# Altium schematic sheet 0177_AUDIO POWER RAILS.SchDoc
size 848 x 558 mm
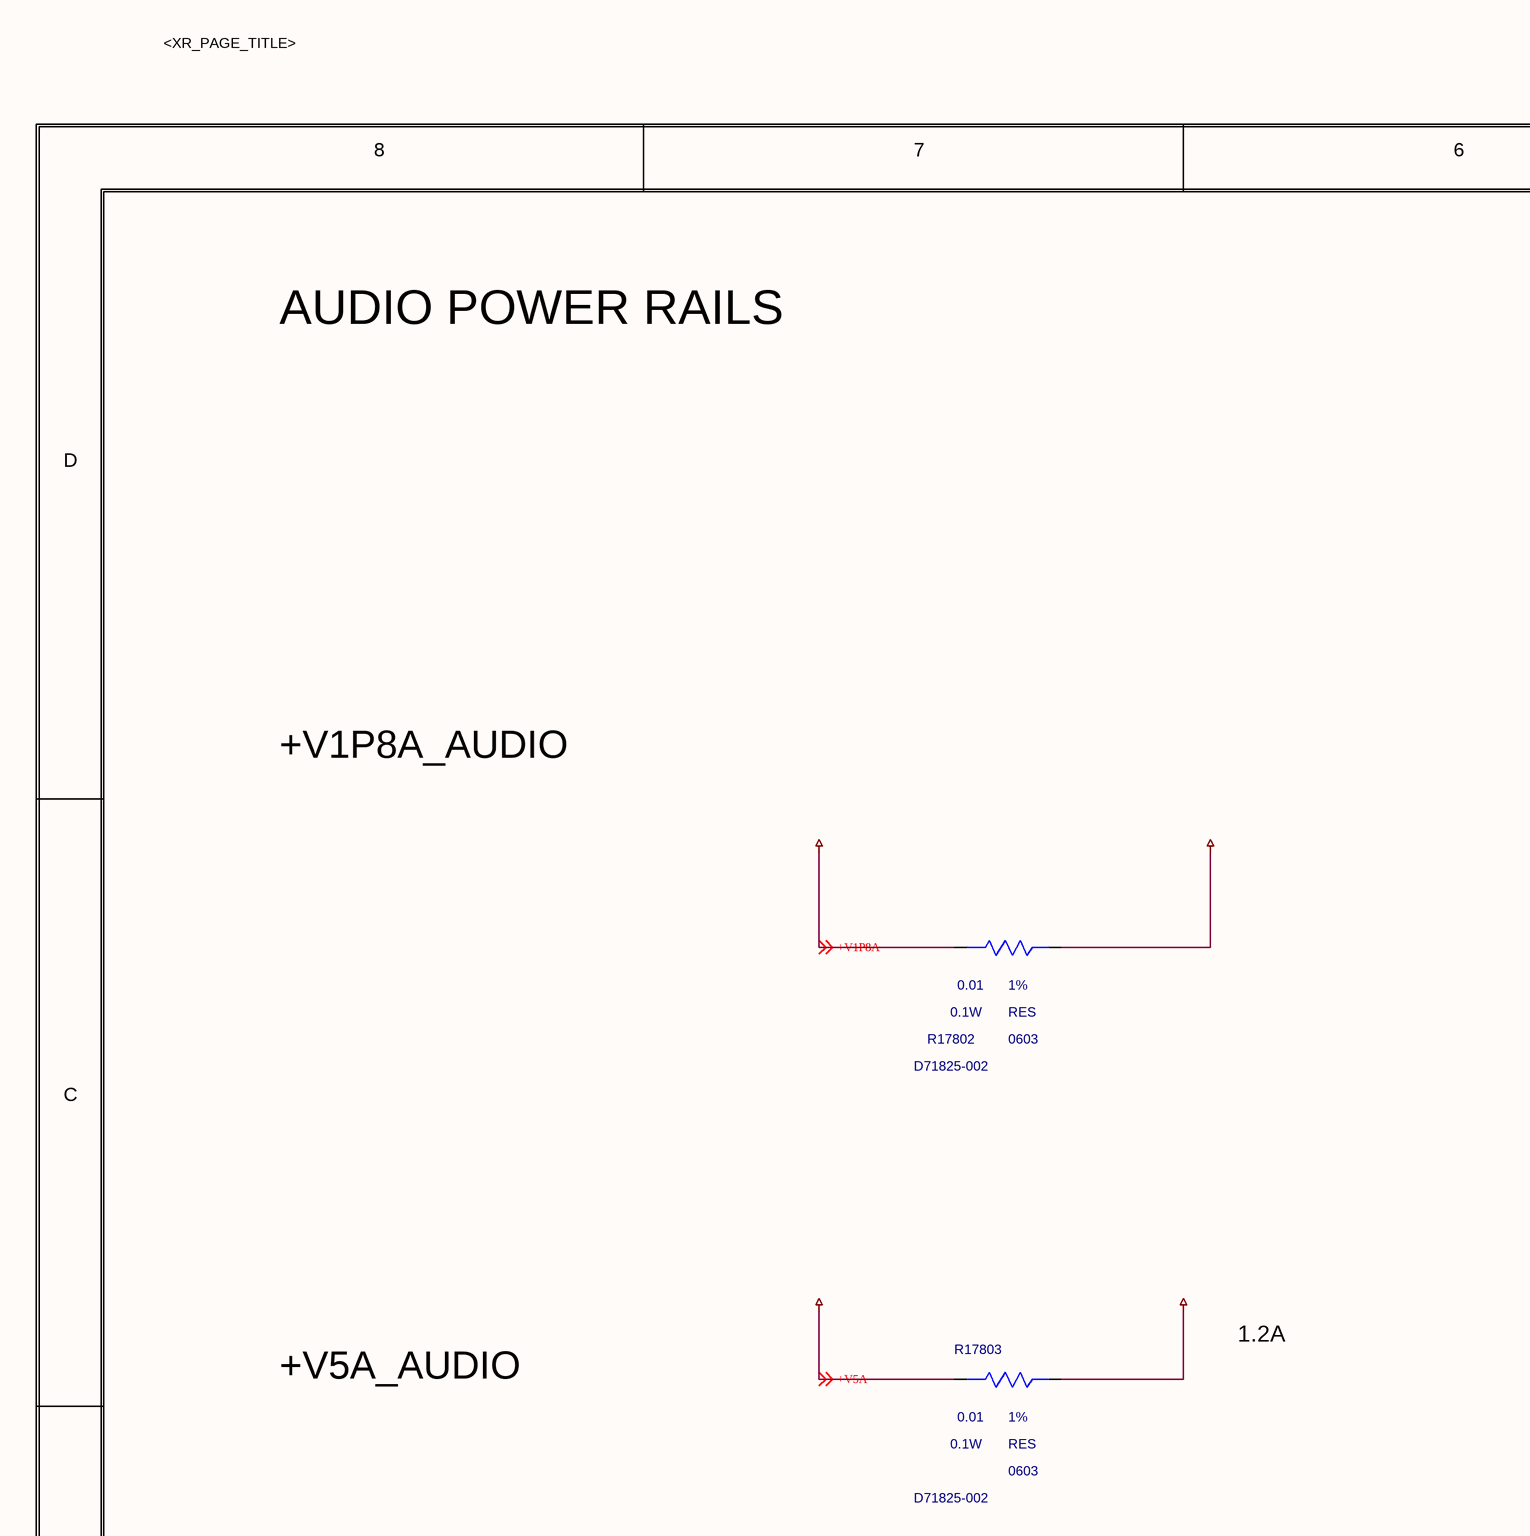
[diagram p0: 0177_AUDIO POWER RAILS.SchDoc, top left]
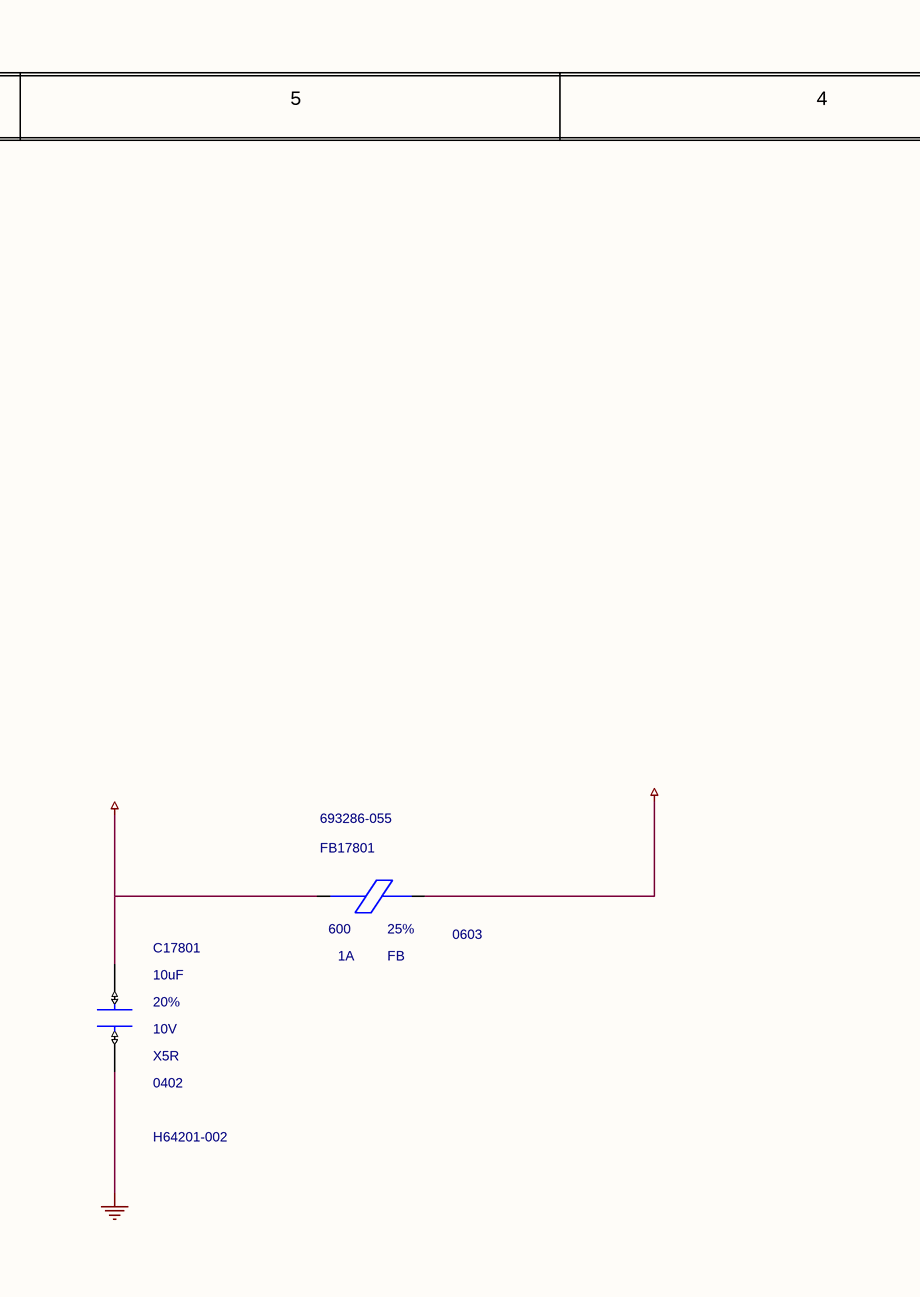
[diagram p1: 0177_AUDIO POWER RAILS.SchDoc, top middle]
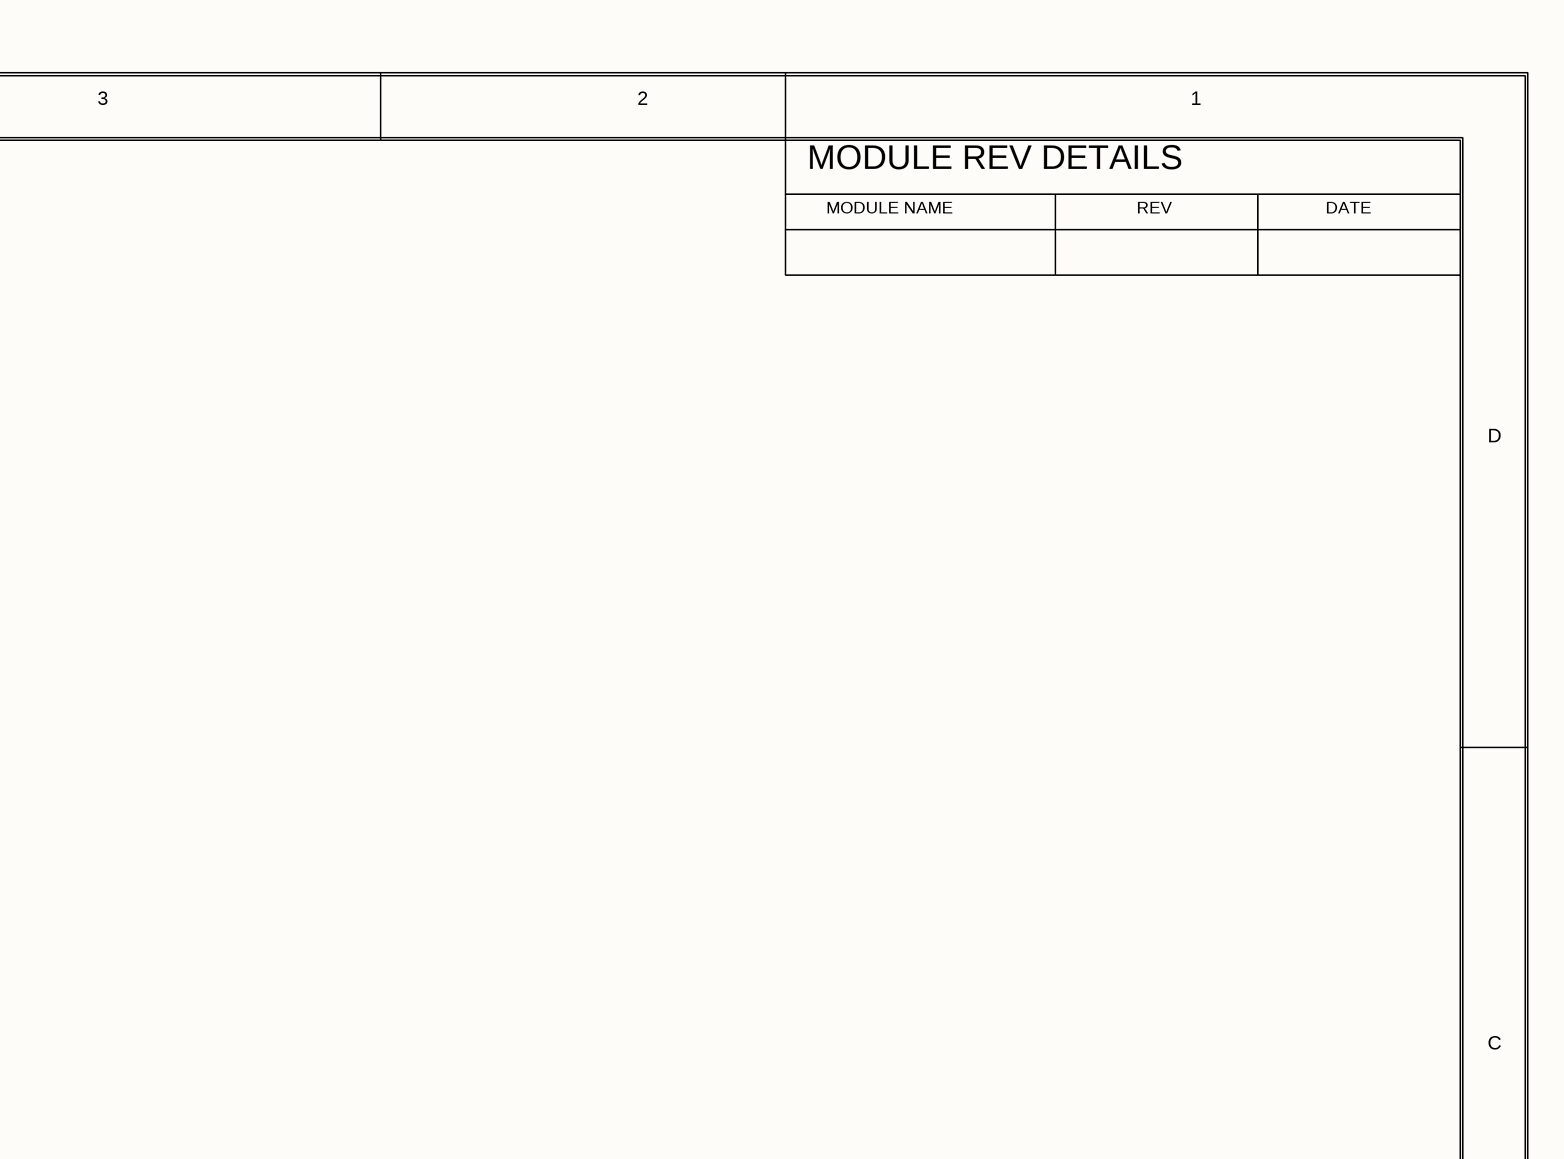
[diagram p2: 0177_AUDIO POWER RAILS.SchDoc, top right]
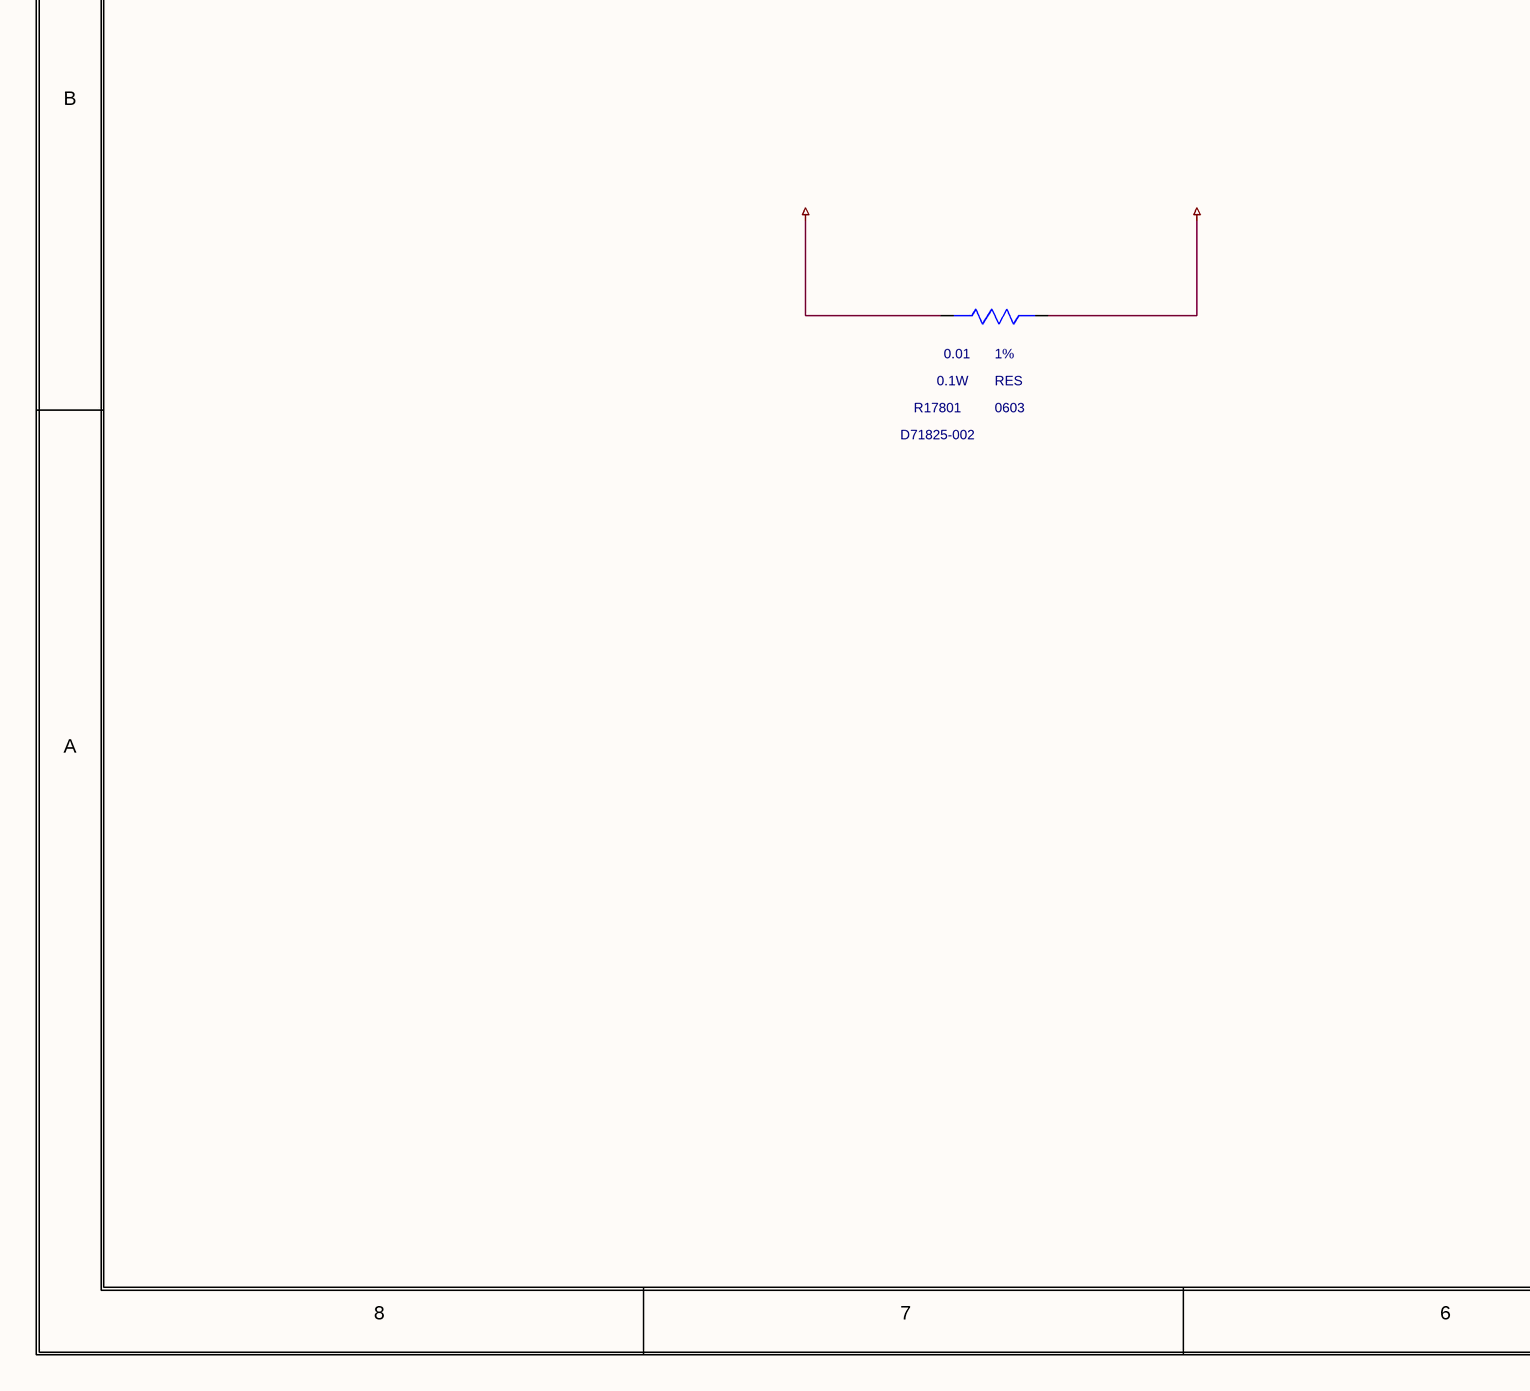
[diagram p3: 0177_AUDIO POWER RAILS.SchDoc, bottom left]
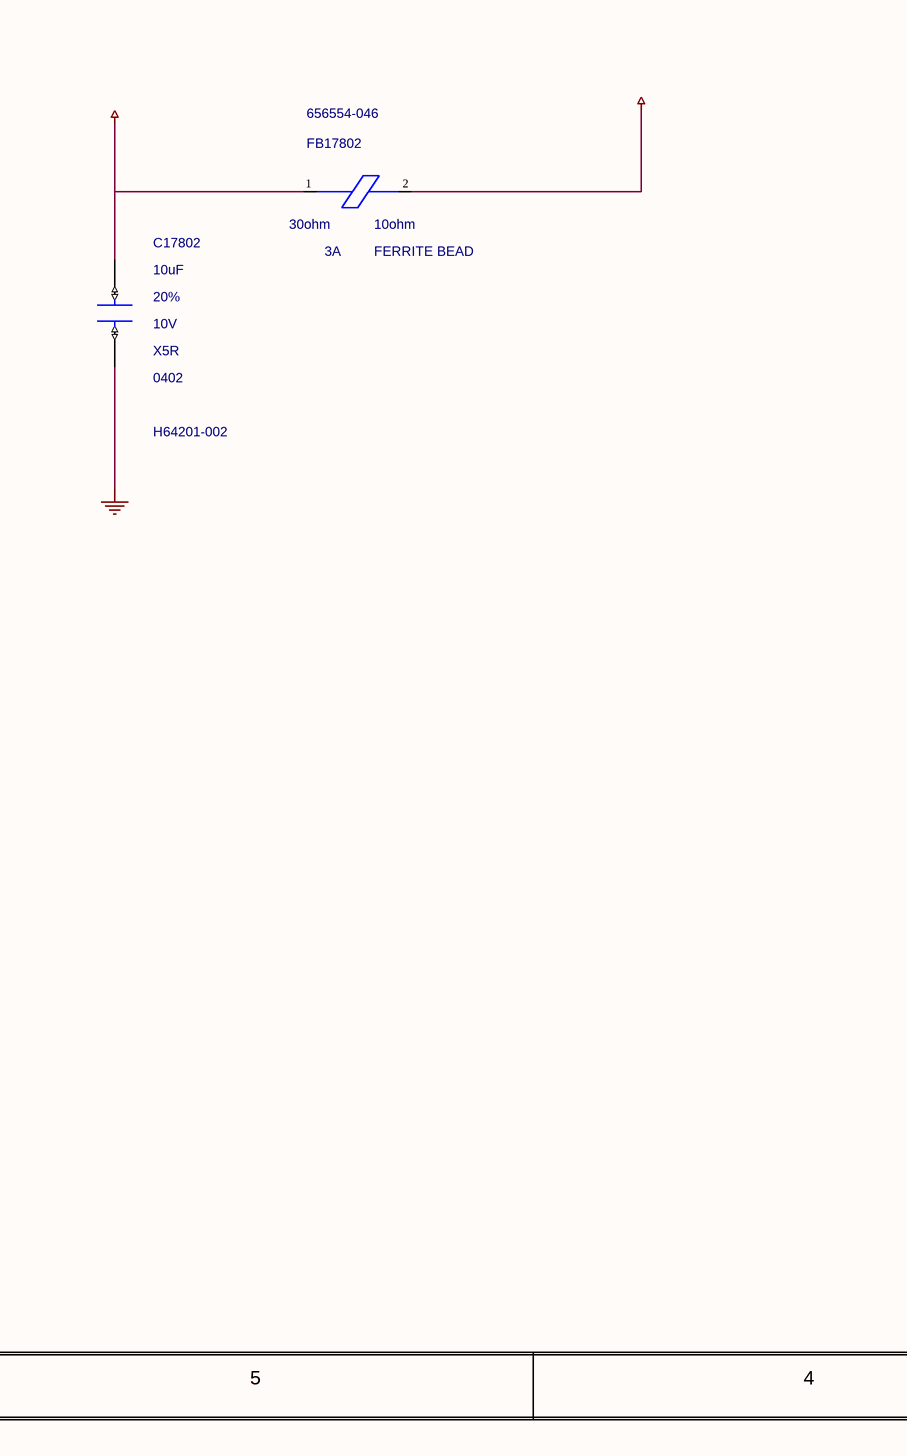
[diagram p4: 0177_AUDIO POWER RAILS.SchDoc, bottom middle]
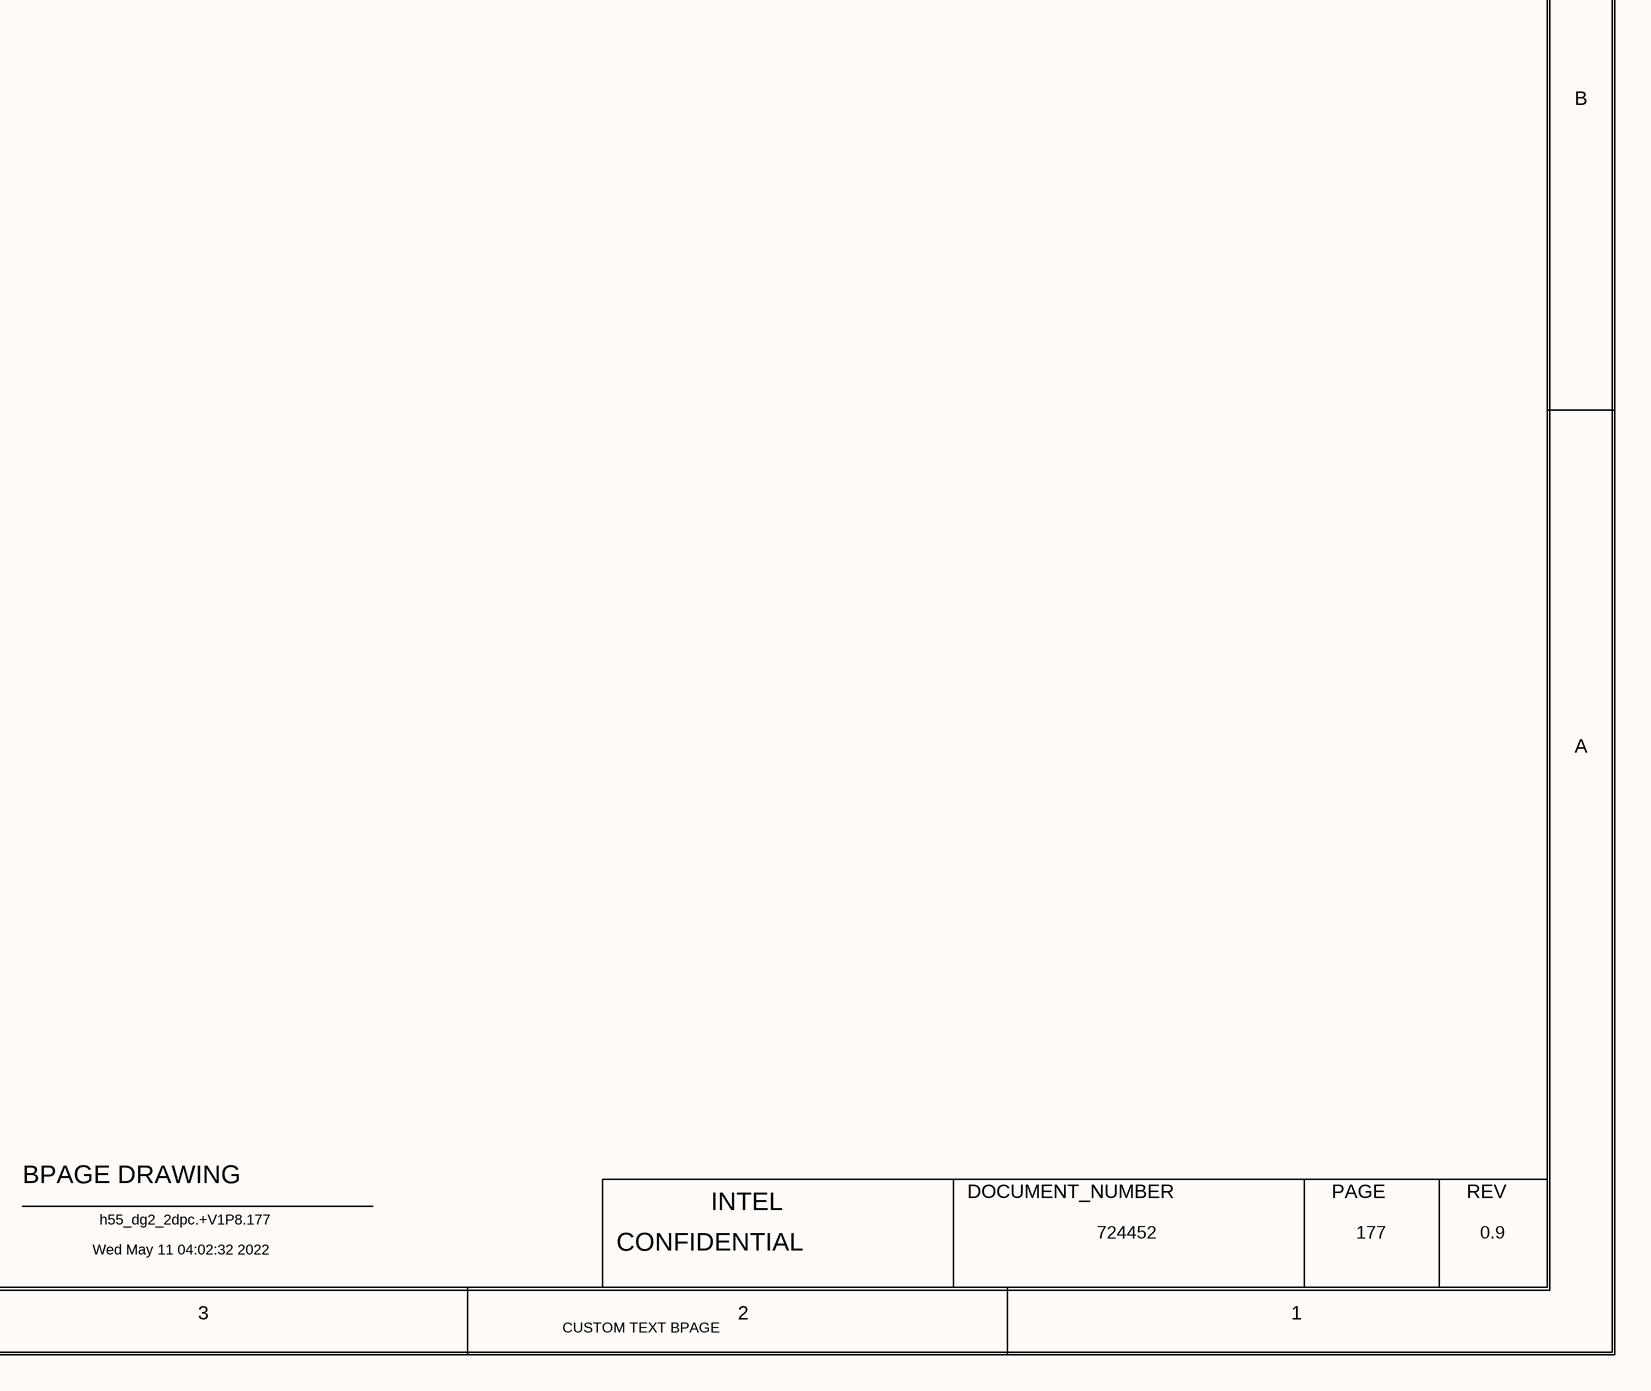
[diagram p5: 0177_AUDIO POWER RAILS.SchDoc, bottom right]

## Parts
C17801  10uF  MATERIAL: X5R  PACK_TYPE: 0402  PART_NUMBER: H64201-002  TOLERANCE: 20%  VOLTAGE: 10V  [CTK2_SM0402_1200X700_MA]
C17802  10uF  MATERIAL: X5R  PACK_TYPE: 0402  PART_NUMBER: H64201-002  TOLERANCE: 20%  VOLTAGE: 10V  [CTK2_SM0402_1200X700_MA]
FB17801  600  CURRENT: 1A  MATERIAL: FB  PACK_TYPE: 0603  PART_NUMBER: 693286-055  TOLERANCE: 25%  [CTK2_SM0603_1750X950_MA]
FB17802  30ohm  CURRENT: 3A  MATERIAL: FERRITE BEAD  PART_NUMBER: 656554-046  TOLERANCE: 10ohm  [SFB0805MA]
R17801  0.01  MATERIAL: RES  PACK_TYPE: 0603  PART_NUMBER: D71825-002  TOLERANCE: 1%  WATTAGE: 0.1W  [CTK2_SM0603_1800X1014_MA]
R17802  0.01  MATERIAL: RES  PACK_TYPE: 0603  PART_NUMBER: D71825-002  TOLERANCE: 1%  WATTAGE: 0.1W  [CTK2_SM0603_1800X1014_MA]
R17803  0.01  MATERIAL: RES  PACK_TYPE: 0603  PART_NUMBER: D71825-002  TOLERANCE: 1%  WATTAGE: 0.1W  [CTK2_SM0603_1800X1014_MA]

## Nets
+V1P8A: R17802.1(A) ; off-sheet +V1P8A
+V1P8A_AUDIO: C17801.1(A) FB17801.1(A) R17802.2(B)
+V1P8A_AUDIO_FIL: FB17801.2(B)
+V5A: R17803.1(A) ; off-sheet +V5A
+V5A_AUDIO: C17802.1(A) FB17802.1(A) R17803.2(B)
+V5A_AUDIO_FIL: FB17802.2(B)
+VBATA: R17801.1(A)
+VBATA_SPK: R17801.2(B)
GND: C17801.2(B) C17802.2(B)

## Notes on the sheet
- <XR_PAGE_TITLE>
- 8
- 7
- 6
- 5
- 4
- 3
- 2
- 1
- MODULE REV DETAILS
- MODULE NAME
- REV
- DATE
- AUDIO POWER RAILS
- D
- +V1P8A_AUDIO
- C
- +V5A_AUDIO
- 1.2A
- B
- A
- BPAGE DRAWING
- INTEL
- DOCUMENT_NUMBER
- PAGE
- Wed May 11 04:02:32 2022
- h55_dg2_2dpc.+V1P8.177
- CONFIDENTIAL
- 724452
- 177
- 0.9
- CUSTOM TEXT BPAGE

## Library data of the parts
C17801 = C_CAP: CDS_PHYS_PART_NAME: C_CAP_0402-H64201-002,X5R,10UF,10V,20%,TK2,GENERIC; CDS_LMAN_SYM_OUTLINE: -50,50,50,-50; FP_TECH: TK2; IP: GENERIC; ROOM: NONE; OriginalSymbolOrigin: (-50,25); XY: (5950,1400); VER: 1; ROT: 0; PHYS_PAGE: 177; LOCATION: C17801; DRAWING: @RVP1_ADL_SB_ADP_S_DDR5_SODIMM_2DPC_LIB.H55_DG2_2DPC(SCH_1):PAGE546; CDS_LIB: c_discrete; VARIANT: ?; PCB Footprint: CTK2_SM0402_1200X700_MA; CHIPS_PART_NAME: C_CAP; CDS_PART_NAME: C_CAP_0402-H64201-002,X5R,10UF,10V,20%,TK2,GENERIC; CDS_LOCATION: C17801
C17802 = C_CAP: CDS_PHYS_PART_NAME: C_CAP_0402-H64201-002,X5R,10UF,10V,20%,TK2,GENERIC; CDS_LMAN_SYM_OUTLINE: -50,50,50,-50; FP_TECH: TK2; IP: GENERIC; ROOM: NONE; OriginalSymbolOrigin: (-50,25); XY: (6000,-50); VER: 1; ROT: 0; PHYS_PAGE: 177; LOCATION: C17802; DRAWING: @RVP1_ADL_SB_ADP_S_DDR5_SODIMM_2DPC_LIB.H55_DG2_2DPC(SCH_1):PAGE546; CDS_LIB: c_discrete; VARIANT: ?; PCB Footprint: CTK2_SM0402_1200X700_MA; CHIPS_PART_NAME: C_CAP; CDS_PART_NAME: C_CAP_0402-H64201-002,X5R,10UF,10V,20%,TK2,GENERIC; CDS_LOCATION: C17802
FB17801 = C_FERRITE: CDS_PHYS_PART_NAME: C_FERRITE_0603-693286-055,FB,600,25%,1A,TK2,GENERIC; CDS_LMAN_SYM_OUTLINE: -50,50,50,-50; FP_TECH: TK2; IP: GENERIC; ROOM: NONE; OriginalSymbolOrigin: (-75,50); XY: (6425,1625); VER: 1; ROT: 0; PHYS_PAGE: 177; LOCATION: FB17801; DRAWING: @RVP1_ADL_SB_ADP_S_DDR5_SODIMM_2DPC_LIB.H55_DG2_2DPC(SCH_1):PAGE546; CDS_LIB: c_discrete; VARIANT: ?; PCB Footprint: CTK2_SM0603_1750X950_MA; CHIPS_PART_NAME: C_FERRITE; CDS_PART_NAME: C_FERRITE_0603-693286-055,FB,600,25%,1A,TK2,GENERIC; CDS_LOCATION: FB17801
FB17802 = FERRITE: CDS_PHYS_PART_NAME: FERRITE_0805-656554-046,FERRITE BEAD,30OHM,10OHM,3A,LPDB,GENERIC; PACK_TYPE: 0805; OriginalSymbolOrigin: (-75,50); XY: (6450,175); VER: 1; ROT: 0; PHYS_PAGE: 177; LOCATION: FB17802; IP: GENERIC; FP_TECH: LPDB; DRAWING: @RVP1_ADL_SB_ADP_S_DDR5_SODIMM_2DPC_LIB.H55_DG2_2DPC(SCH_1):PAGE546; CDS_LIB: discrete; PCB Footprint: SFB0805MA; CHIPS_PART_NAME: FERRITE; CDS_PART_NAME: FERRITE_0805-656554-046,FERRITE BEAD,30OHM,10OHM,3A,LPDB,GENERIC; CDS_LOCATION: FB17802
R17801 = C_RES#1: CHIPS_PART_NAME: C_RES; CDS_PHYS_PART_NAME: C_RES_0603-D71825-002,RES,0.01,1%,0.1W,TK2,GENERIC; CDS_LMAN_SYM_OUTLINE: -50,50,50,-50; FP_TECH: TK2; IP: GENERIC; ROOM: NONE; OriginalSymbolOrigin: (-75,25); XY: (4425,-175); VER: 1; ROT: 0; PHYS_PAGE: 177; LOCATION: R17801; DRAWING: @RVP1_ADL_SB_ADP_S_DDR5_SODIMM_2DPC_LIB.H55_DG2_2DPC(SCH_1):PAGE546; CDS_LIB: c_discrete; VARIANT: ?; PCB Footprint: CTK2_SM0603_1800X1014_MA; CDS_PART_NAME: C_RES_0603-D71825-002,RES,0.01,1%,0.1W,TK2,GENERIC; CDS_LOCATION: R17801
R17802 = C_RES#1: CHIPS_PART_NAME: C_RES; CDS_PHYS_PART_NAME: C_RES_0603-D71825-002,RES,0.01,1%,0.1W,TK2,GENERIC; CDS_LMAN_SYM_OUTLINE: -50,50,50,-50; FP_TECH: TK2; IP: GENERIC; ROOM: NONE; OriginalSymbolOrigin: (-75,25); XY: (4450,1625); VER: 1; ROT: 0; PHYS_PAGE: 177; LOCATION: R17802; DRAWING: @RVP1_ADL_SB_ADP_S_DDR5_SODIMM_2DPC_LIB.H55_DG2_2DPC(SCH_1):PAGE546; CDS_LIB: c_discrete; VARIANT: ?; PCB Footprint: CTK2_SM0603_1800X1014_MA; CDS_PART_NAME: C_RES_0603-D71825-002,RES,0.01,1%,0.1W,TK2,GENERIC; CDS_LOCATION: R17802
R17803 = C_RES#1: CHIPS_PART_NAME: C_RES; CDS_PHYS_PART_NAME: C_RES_0603-D71825-002,RES,0.01,1%,0.1W,TK2,GENERIC; CDS_LMAN_SYM_OUTLINE: -50,50,50,-50; FP_TECH: TK2; IP: GENERIC; ROOM: NONE; OriginalSymbolOrigin: (-75,25); XY: (4450,825); VER: 1; ROT: 0; PHYS_PAGE: 177; LOCATION: R17803; DRAWING: @RVP1_ADL_SB_ADP_S_DDR5_SODIMM_2DPC_LIB.H55_DG2_2DPC(SCH_1):PAGE546; CDS_LIB: c_discrete; VARIANT: ?; PCB Footprint: CTK2_SM0603_1800X1014_MA; CDS_PART_NAME: C_RES_0603-D71825-002,RES,0.01,1%,0.1W,TK2,GENERIC; CDS_LOCATION: R17803